# Altium schematic sheet LAUNCHXL-F28069_B_1400922_1.SchDoc: LAUNCHXL-F28069_B_1400922
size 302 x 238 mm; Origin: Eagle; Date: 2014/12/8 15:08:46; SheetNumber: 2; GateName_1: G$1; SymbolName_1: FRAME_A_L; LibraryName: frames; DeviceSetName: FRAME_A_L; GateName_2: G$2; SymbolName_2: DOCFIELD; Sheet: Sheet:; REV: REV:; COMPANY: COMPANY:; Scale:1/1: Scale: 1/1; Drawn: Drawn; Checked: Checked; Approved: Approved; Embest: Embest
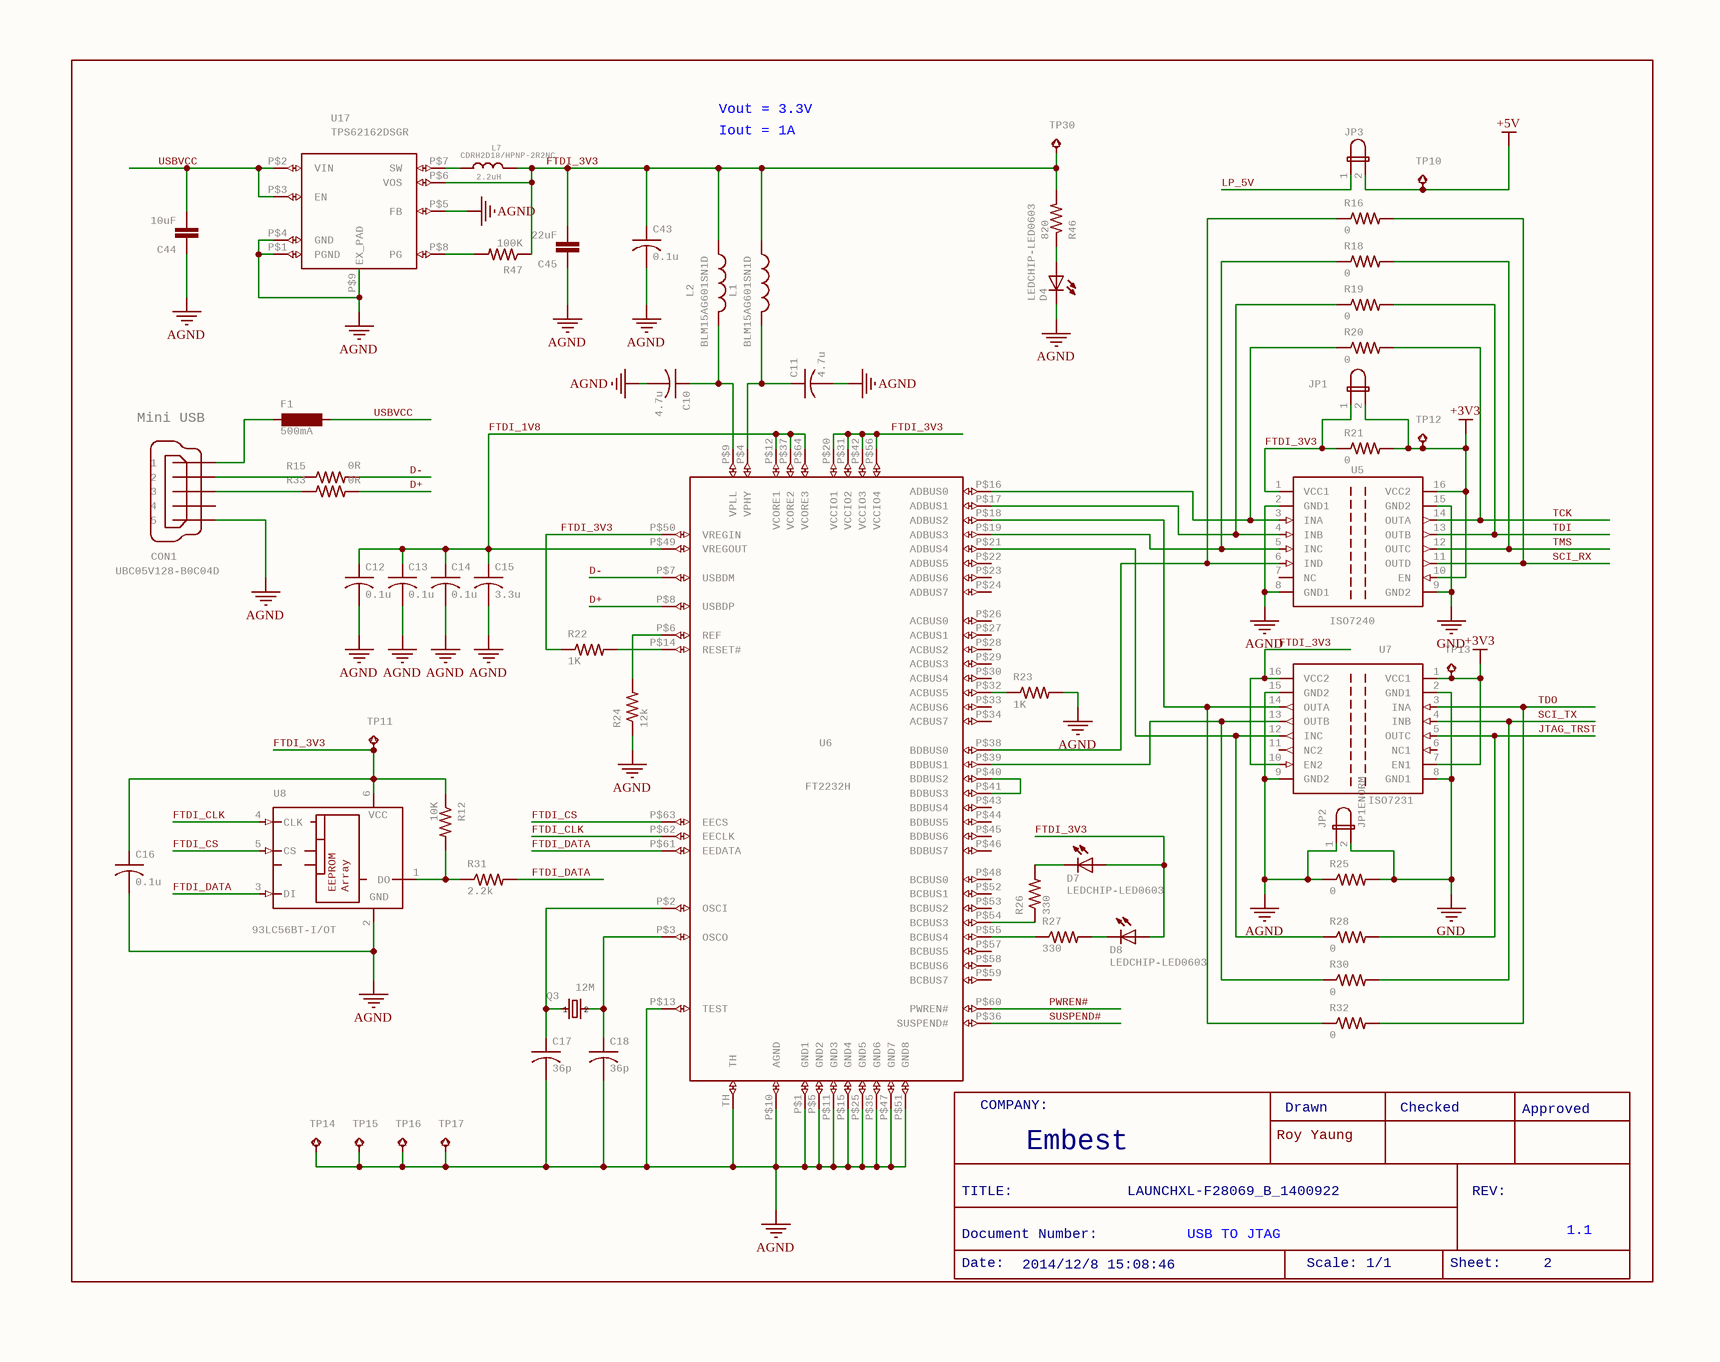
[diagram p0: LAUNCHXL-F28069_B_1400922_1.SchDoc]

## Parts
C10  4.7u  [C0402]
C11  4.7u  [C0402]
C12  0.1u  [C0402]
C13  0.1u  [C0402]
C14  0.1u  [C0402]
C15  3.3u  [C0402]
C16  0.1u  [C0402]
C17  36p  [C0402]
C18  36p  [C0402]
C43  0.1u  [C0402]
C44  10uF  [SPARKFUN_1210]
C45  22uF  [SPARKFUN_1210]
CON1  UBC05V128-B0C04D  [32005-201]
D4  LEDCHIP-LED0603  [CHIP-LED0603]
D7  LEDCHIP-LED0603  [CHIP-LED0603]
D8  LEDCHIP-LED0603  [CHIP-LED0603]
F1  500mA  [L1812]
JP1  JP1ENORM  [JP1]  (value not drawn)
JP2  JP1ENORM  [JP1]
JP3  JP1ENORM  [JP1]  (value not drawn)
L1  BLM15AG601SN1D  [R0402]
L2  BLM15AG601SN1D  [R0402]
L7  2.2uH  [INDUCT-3.2*3.2]
Q3  12M  [HC49UP]
R12  10K  [R0402]
R15  0R  [R0402]
R16  0  [R1206]
R18  0  [R1206]
R19  0  [R1206]
R20  0  [R1206]
R21  0  [R1206]
R22  1K  [R0402]
R23  1K  [R0402]
R24  12k  [R0402]
R25  0  [R1206]
R26  330  [R0402]
R27  330  [R0402]
R28  0  [R1206]
R30  0  [R1206]
R31  2.2k  [R0402]
R32  0  [R1206]
R33  0R  [R0402]
R46  820  [R0402]
R47  100K  [R0402]
TP10  TESTPAD_TPB1,27  [TESTPAD_B1,27]  (value not drawn)
TP11  TESTPAD_TPB1,27  [TESTPAD_B1,27]  (value not drawn)
TP12  TESTPAD_TPB1,27  [TESTPAD_B1,27]  (value not drawn)
TP13  TESTPAD_TPB1,27  [TESTPAD_B1,27]  (value not drawn)
TP14  TESTPAD_TPB1,27  [TESTPAD_B1,27]  (value not drawn)
TP15  TESTPAD_TPB1,27  [TESTPAD_B1,27]  (value not drawn)
TP16  TESTPAD_TPB1,27  [TESTPAD_B1,27]  (value not drawn)
TP17  TESTPAD_TPB1,27  [TESTPAD_B1,27]  (value not drawn)
TP30  TESTPAD_TPB1,27  [TESTPAD_B1,27]  (value not drawn)
U5  ISO7240  [SO-16DW]
U6  FT2232H  [QFN64]
U7  ISO7231  [SO-16DW]
U8  93LC56BT-I/OT  [SOT23-6]
U17  TPS62162DSGR  [TI_DSG8]
U$9  ROY_JUMPER  [ROY_JUMPER]  (value not drawn)
U$10  ROY_JUMPER  [ROY_JUMPER]  (value not drawn)
U$11  ROY_JUMPER  [ROY_JUMPER]  (value not drawn)

## Nets
+3V3: JP1.2 R21.2 TP12.TP TP13.TP U5.10(EN) U5.16(VCC2) U7.1(VCC1) U7.7(EN1)
+5V: JP3.2 TP10.TP
AGND: C10.2 C11.2 C12.2 C13.2 C14.2 C15.2 C16.2 C17.2 C18.2 C43.2 C44.1 C45.1 CON1.5 D4.C JP2.1 R23.2 R24.1 R25.1 TP14.TP TP15.TP TP16.TP TP17.TP U5.2(GND1) U5.8(GND1) U6.P$1(GND1) U6.P$5(GND2) U6.P$10(AGND) U6.P$11(GND3) U6.P$13(TEST) U6.P$15(GND4) U6.P$25(GND5) U6.P$35(GND6) U6.P$47(GND7) U6.P$51(GND8) U6.TH U7.9(GND2) U7.15(GND2) U8.2(GND) U17.P$1(PGND) U17.P$4(GND) U17.P$5(FB) U17.P$9(EX_PAD)
GND: JP2.2 R25.2 U5.9(GND2) U5.15(GND2) U7.2(GND1) U7.8(GND1)
D+: R33.2 U6.P$8(USBDP)
D-: R15.2 U6.P$7(USBDM)
FTDI_1V8: C12.1 C13.1 C14.1 C15.1 U6.P$12(VCORE1) U6.P$37(VCORE2) U6.P$49(VREGOUT) U6.P$64(VCORE3)
FTDI_3V3: C16.1 C43.1 C45.2 D7.A D8.A JP1.1 L1.1 L2.1 L7.P$1 R12.1 R21.1 R22.1 R46.2 R47.1 TP11.TP TP30.TP U5.1(VCC1) U6.P$20(VCCIO1) U6.P$31(VCCIO2) U6.P$42(VCCIO3) U6.P$50(VREGIN) U6.P$56(VCCIO4) U7.10(EN2) U7.16(VCC2) U8.6(VCC) U17.P$6(VOS)
FTDI_CLK: U6.P$62(EECLK) U8.4(CLK)
FTDI_CS: U6.P$63(EECS) U8.5(CS)
FTDI_DATA: R31.2 U6.P$61(EEDATA) U8.3(DI)
JTAG_TRST: R28.2 U7.5(OUTC)
LP_5V: JP3.1
PWREN#: U6.P$60(PWREN#)
SCI_RX: R16.2 U5.11(OUTD)
SCI_TX: R30.2 U7.4(INB)
SUSPEND#: U6.P$36(SUSPEND#)
TCK: R20.2 U5.14(OUTA)
TDI: R19.2 U5.13(OUTB)
TDO: R32.2 U7.3(INA)
TMS: R18.2 U5.12(OUTC)
USBVCC: C44.2 F1.1 U17.P$2(VIN) U17.P$3(EN)
NetC10_1: C10.1 L2.2 U6.P$9(VPLL)
NetC11_1: C11.1 L1.2 U6.P$4(VPHY)
NetC17_1: C17.1 Q3.1 U6.P$2(OSCI)
NetC18_1: C18.1 Q3.2 U6.P$3(OSCO)
NetCON1_1: CON1.1 F1.2
NetCON1_2: CON1.2 R15.1
NetCON1_3: CON1.3 R33.1
NetD4_A: D4.A R46.1
NetD7_C: D7.C R26.2
NetD8_C: D8.C R27.2
NetL7_P$2: L7.P$2 U17.P$7(SW)
NetR12_2: R12.2 R31.1 U8.1(DO)
NetR16_1: R16.1 U5.6(IND) U6.P$38(BDBUS0)
NetR18_1: R18.1 U5.5(INC) U6.P$19(ADBUS3)
NetR19_1: R19.1 U5.4(INB) U6.P$17(ADBUS1)
NetR20_1: R20.1 U5.3(INA) U6.P$16(ADBUS0)
NetR22_2: R22.2 U6.P$14(RESET#)
NetR23_1: R23.1 U6.P$32(ACBUS5)
NetR24_2: R24.2 U6.P$6(REF)
NetR26_1: R26.1 U6.P$54(BCBUS3)
NetR27_1: R27.1 U6.P$55(BCBUS4)
NetR28_1: R28.1 U6.P$21(ADBUS4) U7.12(INC)
NetR30_1: R30.1 U6.P$39(BDBUS1) U7.13(OUTB)
NetR32_1: R32.1 U6.P$18(ADBUS2) U7.14(OUTA)
NetR47_2: R47.2 U17.P$8(PG)
NetU6_P$40: U6.P$40(BDBUS2) U6.P$41(BDBUS3)

Not connected (* = marked no-connect by the designer): CON1 4; U5 7(NC); U6 P$22(ADBUS5) P$23(ADBUS6) P$24(ADBUS7) P$26(ACBUS0) P$27(ACBUS1) P$28(ACBUS2) P$29(ACBUS3) P$30(ACBUS4) P$33(ACBUS6) P$34(ACBUS7) P$43(BDBUS4) P$44(BDBUS5) P$45(BDBUS6) P$46(BDBUS7) P$48(BCBUS0) P$52(BCBUS1) P$53(BCBUS2) P$57(BCBUS5) P$58(BCBUS6) P$59(BCBUS7); U7 6(NC1) 11(NC2)

## Notes on the sheet
- (near L7) CDRH2D18/HPNP-2R2NC
- Vout = 3.3V
- Iout = 1A
- (near CON1) Mini USB
- (near U6) COMPANY:
- Embest
- Roy Yaung
- Drawn
- Checked
- Approved
- TITLE:
- Document Number:
- LAUNCHXL-F28069_B_1400922
- USB TO JTAG
- REV:
- 1.1
- Date:
- 2014/12/8 15:08:46
- Scale: 1/1
- Sheet:
- 2

## Library data of the parts
C10-C18 C43 = C-USC0402: CAPACITOR, American symbol; GateName_1: G$1; SymbolName_1: C-US; DeviceName: C0402; LibraryName: rcl; DeviceSetName: C-US
C44 C45 = SPARKFUN_CAP1210: CapacitorStandard 0603 ceramic capacitor, and 0.1" leaded capacitor.; GateName_1: G$1; DeviceName: 1210; SymbolName_1: SPARKFUN_CAP; LibraryName: RF430FRL152H_EVM_a; DeviceSetName: SPARKFUN_CAP
CON1 = MINI-USB-32005-201: MINI USB-B Conector   Source: www.cypressindustries.com; GateName_1: G$1; SymbolName_1: MINI-USB-5; DeviceName: 32005-201; LibraryName: con-cypressindustries; DeviceSetName: MINI-USB-; MF: MF; MPN: MPN; OC_FARNELL: unknown; OC_NEWARK: unknown
D4 D7 D8 = LEDCHIP-LED0603: LED   OSRAM: - CHIPLED LG R971, LG N971, LY N971, LG Q971, LY Q971, LO R971, LY R971 LH N974, LH R974 LS Q976, LO Q976, LY Q976 LO Q996 - Hyper CHIPLED LW Q18S LB Q993, LB Q99A, LB R99A - SideLED LS A670, LO A670, LY A670, LG A670, LP A670 LB A673, LV A673, LT A673, LW A673 LH A674 LY A675 LS A676, LA A676, LO A676, LY A676, LW A676 LS A679, LY A679, LG A679 -  Hyper Micro SIDELED庐 LS Y876, LA Y876, LO Y876, LY Y876 LT Y87S - SmartLED LW L88C, LW L88S LB L89C, LB L89S, LG L890 LS L89K, LO L89K, LY L89K LS L896, LA L896, LO L896, LY L896 - TOPLED LS T670, LO T670, LY T670, LG T670, LP T670 LSG T670, LSP T670, LSY T670, LOP T670, LYG T670 LG T671, LOG T671, LSG T671 LB T673, LV T673, LT T673, LW T673 LH T674 LS T676, LA T676, LO T676, LY T676, LB T676, LH T676, LSB T676, LW T676 LB T67C, LV T67C, LT T67C, LS T67K, LO T67K, LY T67K, LW E67C LS E67B, LA E67B, LO E67B, LY E67B, LB E67C, LV E67C, LT E67C LW T67C LS T679, LY T679, LG T679 LS T770, LO T770, LY T770, LG T770, LP T770 LB T773, LV T773, LT T773, LW T773 LH T774 LS E675, LA E675, LY E675, LS T675 LS T776, LA T776, LO T776, LY T776, LB T776 LHGB T686 LT T68C, LB T68C - Hyper Mini TOPLED庐 LB M676 - Mini TOPLED Santana庐 LG M470 LS M47K, LO M47K, LY M47K    Source: http://www.osram.convergy.de   LUXEON: - LUMILED庐 LXK2-PW12-R00, LXK2-PW12-S00, LXK2-PW14-U00, LXK2-PW14-V00 LXK2-PM12-R00, LXK2-PM12-S00, LXK2-PM14-U00 LXK2-PE12-Q00, LXK2-PE12-R00, LXK2-PE12-S00, LXK2-PE14-T00, LXK2-PE14-U00 LXK2-PB12-K00, LXK2-PB12-L00, LXK2-PB12-M00, LXK2-PB14-N00, LXK2-PB14-P00, LXK2-PB14-Q00 LXK2-PR12-L00, LXK2-PR12-M00, LXK2-PR14-Q00, LXK2-PR14-R00 LXK2-PD12-Q00, LXK2-PD12-R00, LXK2-PD12-S00 LXK2-PH12-R00, LXK2-PH12-S00 LXK2-PL12-P00, LXK2-PL12-Q00, LXK2-PL12-R00    Source: www.luxeon.com   KINGBRIGHT:   KA-3528ASYC Source: www.kingbright.com; GateName_1: G$1; SymbolName_1: LED; DeviceName: CHIP-LED0603; LibraryName: led; DeviceSetName: LED
F1 = L-EUL1812: INDUCTOR, European symbol; GateName_1: G$1; SymbolName_1: L-EU; DeviceName: L1812; LibraryName: rcl; DeviceSetName: L-EU
JP1-JP3 = JP1ENORM: JUMPER; GateName_1: A; SymbolName_1: JP2E; DeviceName: NORM; DeviceSetName: JP1E; LibraryName: jumper
L1 L2 = L-US0402: INDUCTOR, American symbol; GateName_1: G$1; SymbolName_1: L-US; DeviceName: 0402; LibraryName: rcl; DeviceSetName: L-US
L7 = VLF4012A`: GateName_1: 1; SymbolName_1: INDUCTOR; DeviceName: `; LibraryName: LAUNCHXL-F28027; DeviceSetName: VLF4012A
Q3 = CRYSTALHC49UP: CRYSTAL; GateName_1: G$1; SymbolName_1: Q; DeviceName: HC49UP; LibraryName: crystal; DeviceSetName: CRYSTAL; 1: 1; 2: 2; MF: MF; MPN: MPN; OC_FARNELL: unknown; OC_NEWARK: unknown
R12 R15 R22-R24 R26 R27 R31 R33 R46 R47 = R-US_R0402: RESISTOR, American symbol; GateName_1: G$1; SymbolName_1: R-US; DeviceSetName: R-US_; DeviceName: R0402; LibraryName: rcl
R16 R18-R21 R25 R28 R30 R32 = R-US_R1206: RESISTOR, American symbol; GateName_1: G$1; SymbolName_1: R-US; DeviceSetName: R-US_; DeviceName: R1206; LibraryName: rcl
TP10-TP17 TP30 = TESTPAD_TPB1,27: Test pad; GateName_1: G$1; DeviceName: B1,27; SymbolName_1: TESTPAD_TP; LibraryName: RF430FRL152H_EVM_a; DeviceSetName: TESTPAD_TP
U5 = ISO7240: HIGH SPEED QUAD DIGITAL ISOLATORS   Source: http://focus.ti.com/lit/ds/symlink/iso7240m.pdf; MPN: ISO7240MDW; GateName_1: G$1; SymbolName_1: ISO7240; LibraryName: texas; DeviceSetName: ISO7240; MF: MF; OC_FARNELL: 1755124; OC_NEWARK: 58M0385
U6 = FT2232H: GateName_1: G$1; SymbolName_1: FT2232H; LibraryName: ti_trey; DeviceSetName: FT2232H
U7 = ISO7231: GateName_1: G$1; SymbolName_1: ISO7231; LibraryName: texas; DeviceSetName: ISO7231
U8 = 93*: Serial EPROM   1 K/2 K/4 K, low voltage, Microwire; GateName_1: G$1; SymbolName_1: 93LC46; LibraryName: ti_trey; DeviceSetName: 93*; Array: Array; VCC: VCC; GND: GND; EEPROM: EEPROM
U17 = TPS62162DSGR: GateName_1: G$1; SymbolName_1: TPS62162; LibraryName: LAUNCHXL-F28027; DeviceSetName: TPS62162DSGR
U$9-U$11 = ROY_JUMPER: GateName_1: G$1; SymbolName_1: ROY_JUMPER; LibraryName: roy; DeviceSetName: ROY_JUMPER